# Altium schematic sheet mcu.SchDoc
size A4
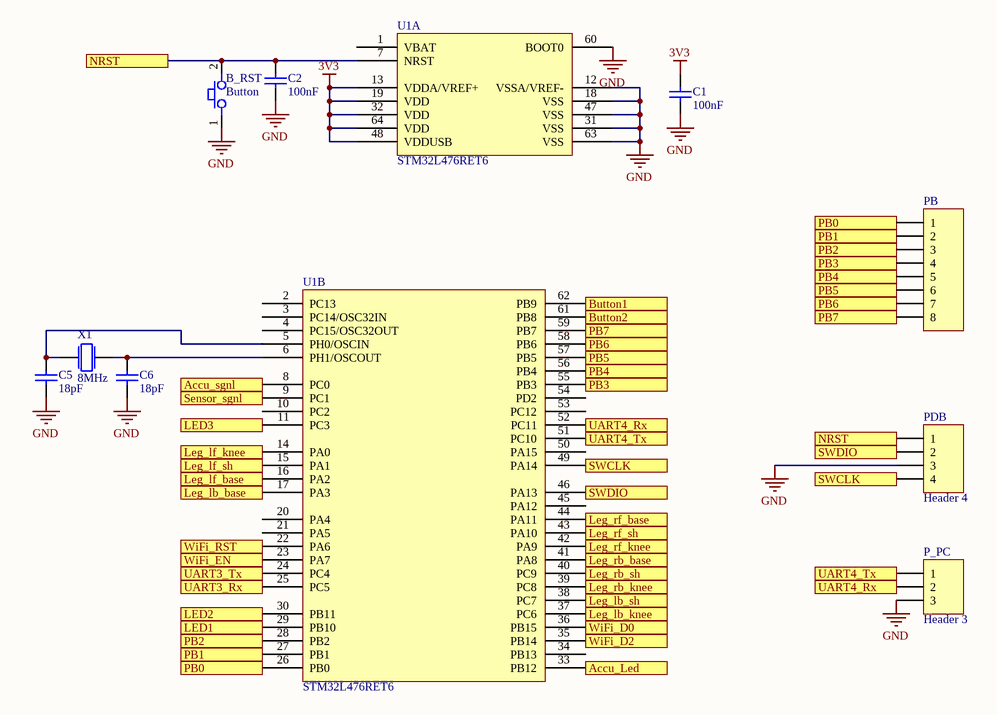
[diagram p0: mcu.SchDoc]

## Parts
B_RST  Button  [Button]
C1  100nF  [FP_0805_CAP_085]
C2  100nF  [FP_0805_CAP_085]
C5  18pF  [FP_0805_CAP_085]
C6  18pF  [FP_0805_CAP_085]
P_PC  Header 3  [HDR1X3]
PB  (no value)  [HDR1X8]
PDB  Header 4  [HDR1X4]
U1  STM32L476RET6  [STM32L476RET6]  (parts A,B of 2)
X1  8MHz  [OSC]

## Ports
Accu_Led, Accu_sgnl, Button1, Button2, LED1, LED2, LED3, Leg_lb_base, Leg_lb_knee, Leg_lb_sh, Leg_lf_base, Leg_lf_knee, Leg_lf_sh, Leg_rb_base, Leg_rb_knee, Leg_rb_sh, Leg_rf_base, Leg_rf_knee, Leg_rf_sh, NRST, PB0, PB1, PB2, PB3, PB4, PB5, PB6, PB7, Sensor_sgnl, SWCLK, SWDIO, UART3_Rx, UART3_Tx, UART4_Rx, UART4_Tx, WiFi_D0, WiFi_D2, WiFi_EN, WiFi_RST

## Nets
3V3: C1.2 U1.13(VDDA/VREF+) U1.19(VDD) U1.32(VDD) U1.48(VDDUSB) U1.64(VDD)
GND: B_RST.1 C1.1 C2.1 C5.1 C6.1 P_PC.3 PDB.3 U1.12(VSSA/VREF-) U1.18(VSS) U1.31(VSS) U1.47(VSS) U1.60(BOOT0) U1.63(VSS)
Accu_Led: U1.33(PB12) ; port Accu_Led
Accu_sgnl: U1.8(PC0) ; port Accu_sgnl
Button1: U1.62(PB9) ; port Button1
Button2: U1.61(PB8) ; port Button2
LED1: U1.29(PB10) ; port LED1
LED2: U1.30(PB11) ; port LED2
LED3: U1.11(PC3) ; port LED3
Leg_lb_base: U1.17(PA3) ; port Leg_lb_base
Leg_lb_knee: U1.37(PC6) ; port Leg_lb_knee
Leg_lb_sh: U1.38(PC7) ; port Leg_lb_sh
Leg_lf_base: U1.16(PA2) ; port Leg_lf_base
Leg_lf_knee: U1.14(PA0) ; port Leg_lf_knee
Leg_lf_sh: U1.15(PA1) ; port Leg_lf_sh
Leg_rb_base: U1.41(PA8) ; port Leg_rb_base
Leg_rb_knee: U1.39(PC8) ; port Leg_rb_knee
Leg_rb_sh: U1.40(PC9) ; port Leg_rb_sh
Leg_rf_base: U1.44(PA11) ; port Leg_rf_base
Leg_rf_knee: U1.42(PA9) ; port Leg_rf_knee
Leg_rf_sh: U1.43(PA10) ; port Leg_rf_sh
NRST: B_RST.2 C2.2 PDB.1 U1.7(NRST) ; port NRST
PB0: PB.1 U1.26(PB0) ; port PB0
PB1: PB.2 U1.27(PB1) ; port PB1
PB2: PB.3 U1.28(PB2) ; port PB2
PB3: PB.4 U1.55(PB3) ; port PB3
PB4: PB.5 U1.56(PB4) ; port PB4
PB5: PB.6 U1.57(PB5) ; port PB5
PB6: PB.7 U1.58(PB6) ; port PB6
PB7: PB.8 U1.59(PB7) ; port PB7
Sensor_sgnl: U1.9(PC1) ; port Sensor_sgnl
SWCLK: PDB.4 U1.49(PA14) ; port SWCLK
SWDIO: PDB.2 U1.46(PA13) ; port SWDIO
UART3_Rx: U1.25(PC5) ; port UART3_Rx
UART3_Tx: U1.24(PC4) ; port UART3_Tx
UART4_Rx: P_PC.2 U1.52(PC11) ; port UART4_Rx
UART4_Tx: P_PC.1 U1.51(PC10) ; port UART4_Tx
WiFi_D0: U1.36(PB15) ; port WiFi_D0
WiFi_D2: U1.35(PB14) ; port WiFi_D2
WiFi_EN: U1.23(PA7) ; port WiFi_EN
WiFi_RST: U1.22(PA6) ; port WiFi_RST
NetC5_2: C5.2 U1.5(PH0/OSCIN) X1.1
NetC6_2: C6.2 U1.6(PH1/OSCOUT) X1.2

Not connected (* = marked no-connect by the designer): U1 1(VBAT) 2(PC13) 3(PC14/OSC32IN) 4(PC15/OSC32OUT) 10(PC2) 20(PA4) 21(PA5) 34(PB13) 45(PA12) 50(PA15) 53(PC12) 54(PD2)

## Library data of the parts
B_RST = Button: Name: TACT 2.5x 3 2P SPST B3U-1000P (OMR) 2.5x3x1.2mm SMD H=1.2mm 153g; Reference: 45-09-96; Supplier: Lomex
C1 C2 = CAP 100nF: Capacitor; Tolerance: 10%; Voltage: 50V; Name: 100nF 0805 10% 50V X7R 0805B104K500CT (WAL); Supplier: Lomex; Reference: 82-10-76; Value: 100nF
C5 C6 = CAP: Capacitor; Tolerance: 5%; Voltage: 50V; Name: 18pF 0805 5% 50V NP0 CL21C180JBANNNC (SAM); Supplier: Lomex; Reference: 82-08-38; Value: 18pF
P_PC = Header 3: Header, 3-Pin; LatestRevisionDate: 17-Jul-2002; LatestRevisionNote: Re-released for DXP Platform.; Publisher: Altium Limited
PB = Header 8: Header, 8-Pin; Name: TÜSKESOR 40 P PHSS-40- 6/3 (T-T) 2.54mm PIN 0.64x0.64 TÖRDELHETÖ; LatestRevisionDate: 17-Jul-2002; LatestRevisionNote: Re-released for DXP Platform.; Publisher: Altium Limited; Reference: 43-00-73; Supplier: Lomex
PDB = Header 4: Header, 4-Pin; LatestRevisionDate: 17-Jul-2002; LatestRevisionNote: Re-released for DXP Platform.; Publisher: Altium Limited
U1 = STM32L476RET6: Manufacturer: STMICROELECTRONICS; Reference: 2494459; Name: STM32L476RET6 -  ARM Microcontroller, Ultra Low Power, STM32 Family STM32L4 Series Microcontrollers, 32bit, 80 MHz; Manufacturer Part No: STM32L476RET6; Component Type: IC; Supplier: Farnell
X1 = Crystal: Quarz Crystal; Reference: 2508478; Name: QCS8.00000F18B23M -  Crystal, 8 MHz, SMD, 12.5mm x 4.6mm, 30 ppm, 18 pF, 20 ppm, QCS Series; Value: 8MHz; Supplier: Farnell